# Altium schematic sheet XO_125M.SchDoc: SPEC-A7
size 420 x 297 mm; Author: G.Kasprowicz; CompanyName: WUT ISE; DrawnBy: G.Kasprowicz; Organization: WUT ISE; Address1: PW ISE; Address2: Nowowiejska 15/19 00-665 Warsaw; Address3: gkasprow@gmail.com; Revision: 2; SheetNumber: 9; SheetTotal: 18; ModifiedBy: -; CheckedDate: -; Title2: 125M VCXO; DivGrp: WUT ISE; Designer: G.Kasprowicz; ModifiedDate: -; ProjectName: Sensor Box
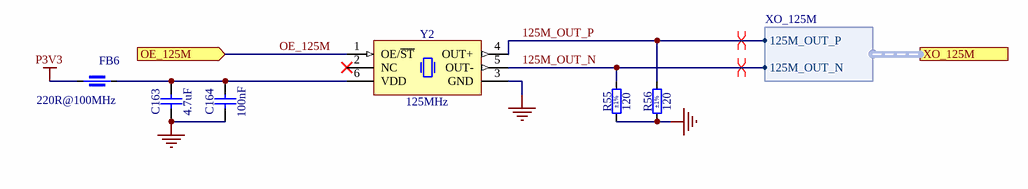
[diagram p0: XO_125M.SchDoc]

## Parts
C163  4.7uF  [CAPC1005X55N]
C164  100nF  [CAPC0603X33N]
FB6  220R@100MHz  [INDC1608X95N]
R55  120  Tolerance: ±1%  [RESC1005X40N]
R56  120  Tolerance: ±1%  [RESC1005X40N]
Y2  125MHz  [OSC_SI-TIME_SIT9121-C]

## Ports
OE_125M (in, see SPEC-A7-TOP[3C], FPGA_14_15[4C]), XO_125M (harness XO_125M, see SPEC-A7-TOP[3C], FPGA_MGT[1D])

## Harnesses
XO_125M: 125M_OUT_P, 125M_OUT_N

## Nets
GND: C163.1 C164.1 R55.1 R56.1 Y2.3(GND)
P3V3: FB6.1
125M_OUT_N: R55.2 Y2.5(OUT-) ; port XO_125M.125M_OUT_N
125M_OUT_P: R56.2 Y2.4(OUT+) ; port XO_125M.125M_OUT_P
OE_125M: Y2.1(OE/~{ST}) ; port OE_125M
NetC163_2: C163.2 C164.2 FB6.2 Y2.6(VDD)

Not connected (* = marked no-connect by the designer): Y2 2(NC)*

## Layout directives
differential pair: 125M_OUT_N, 125M_OUT_P

## Notes on the sheet
- Project/Equipment
- Document
- Designer
- Drawn by
- Check.by
- Copyright WUT ISE 2024.
  This documentation describes Open Hardware and is licensed under the CERN OHL v.2. You may redistribute and modify this documentation under the terms of the CERN OHL v.2. (http://ohwr.org/CERNOHL). This documentation is distributed WITHOUT ANY EXPRESS OR IMPLIED WARRANTY, INCLUDING OF MERCHANTABILITY, SATISFACTORY QUALITY AND FITNESS FOR A PARTICULAR PURPOSE. Please see the CERN OHL v.2 for applicable conditions.
- Contact
- File
- Last Mod.
- Print Date
- Sheet
- Size
- A3
- of
- Rev

## Library data of the parts
C163 = CC0402_4.7UF_6.3V_20%_X5R: Non-polarised capacitor; Part Description: SMD Multilayer Chip Ceramic Capacitor; Manufacturer: GENERIC; Manufacturer1 Part Number: C1005X5R0J475M050BC; Voltage: 6.3V; TC: X5R; Tolerance: ±20%; Part Number: CC0402_4.7UF_6.3V_20%_X5R; Component Kind: Standard; Component Type: Standard; Pin Count: 2; Value: 4.7uF; Status: Preferred; Manufacturer Part Number: CC0402_4.7UF_6.3V_20%_X5R; Case: 0402; Mounted: Yes; Socket: No; SMD: Yes; Sense: No; Manufacturer1 Example: TDK; Manufacturer1 ComponentHeight: 0.65mm; HelpURL: \\cern.ch\dfs\Applications\Altium\Datasheets\CC0402_X5R_TDK_C.pdf; Author: CERN DEM JLC; CreateDate: 03.03.2015; LatestRevisionDate: 03.03.2015
C164 = CC0201_100NF_6.3V_10%_X5R: Non-polarised capacitor; Part Description: SMD Multilayer Chip Ceramic Capacitor; Manufacturer: GENERIC; Manufacturer1 Part Number: 02016D104KAT2A; Voltage: 6.3V; TC: X5R; Tolerance: ±10%; Part Number: CC0201_100NF_6.3V_10%_X5R; Component Kind: Standard; Component Type: Standard; Pin Count: 2; Value: 100nF; Status: Not Recommended; Manufacturer Part Number: CC0201_100NF_6.3V_10%_X5R; Case: 0201; Mounted: Yes; Socket: No; SMD: Yes; Sense: No; Manufacturer1 Example: AVX; Manufacturer1 ComponentHeight: 0.33mm; HelpURL: \\cern.ch\dfs\Applications\Altium\Datasheets\CC0201_X5R_AVX.pdf; Author: CERN DEM JLC; CreateDate: 03.12.2007; LatestRevisionDate: 03.12.2007
FB6 = IND0603_MURATA_BLM18SG221TN1: Part Description: SMD EMIFIL Suppression Chip Ferrite Bead; Manufacturer: MURATA; Tolerance: ±25%; Power: 2.5A; Resistance: 0.04R; Part Number: IND0603_MURATA_BLM18SG221TN1; Component Kind: Standard; Component Type: Standard; Pin Count: 2; Value: 220R@100MHz; Manufacturer Part Number: BLM18SG221TN1; Case: 0603; Mounted: Yes; Socket: No; SMD: Yes; Sense: No; ComponentHeight: 0.95mm; HelpURL: \\cern.ch\dfs\Applications\Altium\Datasheets\IND0603_MURATA_BLM18S.pdf; Author: CERN DEM MR; CreateDate: 08.01.2016; LatestRevisionDate: 25.10.2018
R55 R56 = R0402_120R_1%_0.0625W_100PPM: Resistor - 1%; Part Description: General Purpose Thick Film Chip Resistor; Manufacturer: GENERIC; Manufacturer1 Part Number: 232270671201L; TC: ±100ppm/°C; PressFit: No; Part Number: R0402_120R_1%_0.0625W_100PPM; Component Kind: Standard; Component Type: Standard; Pin Count: 2; Value: 120; Status: Not Recommended; Power: 0.0625W; Manufacturer Part Number: R0402_120R_1%_0.0625W_100PPM; Case: 0402; Mounted: Yes; Sense: No; Socket: No; SMD: Yes; Manufacturer1 Example: YAGEO PHYCOMP; Manufacturer1 ComponentHeight: 0.4mm; HelpURL: \\cern.ch\dfs\Applications\Altium\Datasheets\R0402_Phycomp_RC0402.pdf; Author: CERN DEM JLC; CreateDate: 03.12.2007; LatestRevisionDate: 17.10.2012
Y2 = OSC_125MHZ_SI-TIME_SIT9121AI-2C2-33E125.000000: Standard Frequency Differential Oscillator; Part Description: 3.3V, ±25ppm, -40..85°C, 3.2x5.0mm Surface Mount LVDS High Performance Differential Oscillator (SIT9121 Series); Manufacturer: SI TIME; PressFit: No; Bonding: No; Part Number: OSC_125MHZ_SI-TIME_SIT9121AI-2C2-33E125.000000; Component Kind: Standard; Component Type: Standard; PackageDescription: SiT9121 Series Package C, Oscillators, Version 3.2.0mm x 5.0mm, Pitch 1.27mm; 6 Pin; Value: 125MHz; Manufacturer Part Number: SIT9121AI-2C2-33E125.000000; Pin Count: 6; Mounted: Yes; Socket: No; SMD: Yes; Sense: No; ComponentHeight: 0.8mm; HelpURL: \\cern.ch\dfs\Applications\Altium\Datasheets\OSC_SI-TIME_SIT9121.pdf; Author: CERN DEM HF; CreateDate: 06.12.2024; LatestRevisionDate: 06.12.2024